# Altium schematic sheet STM32_BOARD_v1a_main.SchDoc: MCU & Motor Interface
size A4; Date: 2022-1-8; Author: Aljaž Murovec; DrawnBy: Aljaž murovec; Engineer: Aljaž Murovec; Revision: A; SheetNumber: 1; SheetTotal: 2
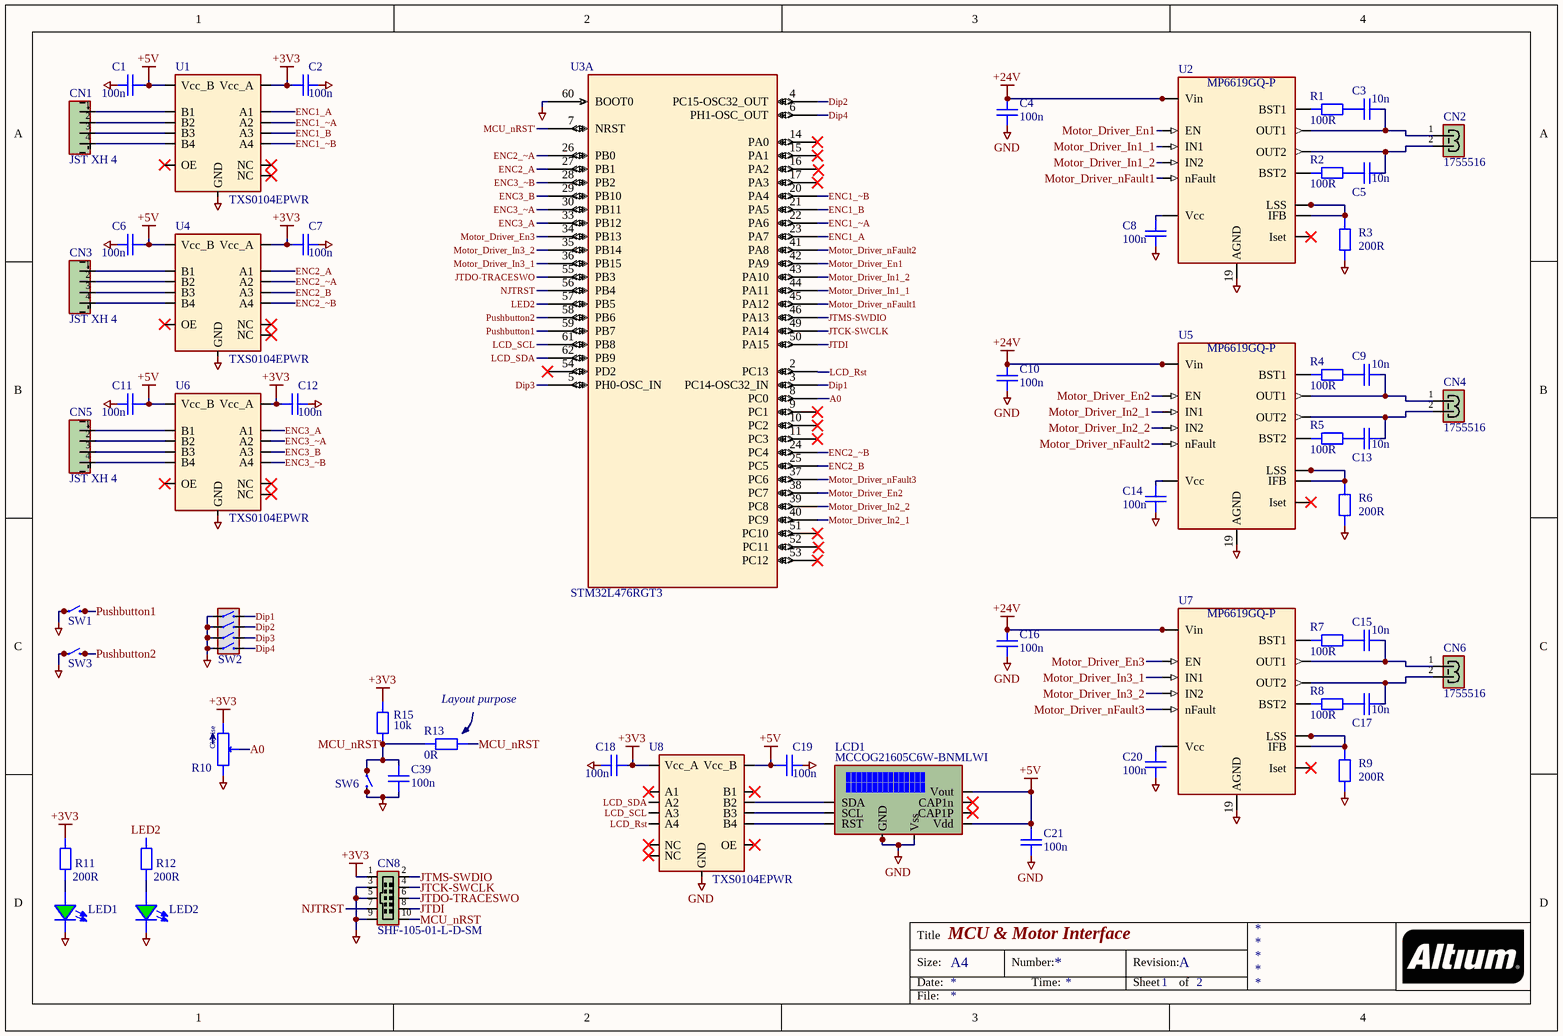
[diagram p0: STM32_BOARD_v1a_main.SchDoc]

## Parts
C1  100n  [CAP_SMD]
C2  100n  [CAP_SMD]
C3  10n  [CAP_SMD]
C4  100n  [CAP_SMD]
C5  10n  [CAP_SMD]
C6  100n  [CAP_SMD]
C7  100n  [CAP_SMD]
C8  100n  [CAP_SMD]
C9  10n  [CAP_SMD]
C10  100n  [CAP_SMD]
C11  100n  [CAP_SMD]
C12  100n  [CAP_SMD]
C13  10n  [CAP_SMD]
C14  100n  [CAP_SMD]
C15  10n  [CAP_SMD]
C16  100n  [CAP_SMD]
C17  10n  [CAP_SMD]
C18  100n  [CAP_SMD]
C19  100n  [CAP_SMD]
C20  100n  [CAP_SMD]
C21  100n  [CAP_SMD]
C39  100n  [CAP_SMD]
CN1  JST XH 4  [JST_XH_4-PIN]
CN2  PHOENIX_CONTACT_2x1_  [1755516]  (value not drawn)
CN3  JST XH 4  [JST_XH_4-PIN]
CN4  PHOENIX_CONTACT_2x1_  [1755516]  (value not drawn)
CN5  JST XH 4  [JST_XH_4-PIN]
CN6  PHOENIX_CONTACT_2x1_  [1755516]  (value not drawn)
CN8  SHF-105-01-L-D-SM  [SHF-105-01-L-D-SM]
LCD1  MCCOG21605C6W-BNMLWI  [MCCOG21605C6W-BNMLWI]
LED1  LED_SMD_GREEN  [LED_0805_GREEN]  (value not drawn)
LED2  LED_SMD_GREEN  [LED_0805_GREEN]  (value not drawn)
R1  100R  [RES_0805]
R2  100R  [RES_0805]
R3  200R  [RES_0805]
R4  100R  [RES_0805]
R5  100R  [RES_0805]
R6  200R  [RES_0805]
R7  100R  [RES_0805]
R8  100R  [RES_0805]
R9  200R  [RES_0805]
R10  TC33X-2-502E  [TC33X-2]  (value not drawn)
R11  200R  [RES_0805]
R12  200R  [RES_0805]
R13  0R  [RES_0805]
R15  10k  [RES_0805]
SW1  PTS645SM43SMTR92LFS  [Pushbutton_6x6mm]  (value not drawn)
SW2  A6H-4101  [A6H-4101]  (value not drawn)
SW3  PTS645SM43SMTR92LFS  [Pushbutton_6x6mm]  (value not drawn)
SW6  PTS645SM43SMTR92LFS  [Pushbutton_6x6mm]  (value not drawn)
U1  TXS0104EPWR  [TSOP65P640X120-14N]
U2  MP6619GQ-P  [MP6619GQ-P]
U3  32-bit Microcontroller  [LQFP64_10x10mm]  (value not drawn)  (part A of 2)
U4  TXS0104EPWR  [TSOP65P640X120-14N]
U5  MP6619GQ-P  [MP6619GQ-P]
U6  TXS0104EPWR  [TSOP65P640X120-14N]
U7  MP6619GQ-P  [MP6619GQ-P]
U8  TXS0104EPWR  [TSOP65P640X120-14N]

## Nets
+3V3: C2.2(Pin_2) C7.2(Pin_2) C12.2(Pin_2) C18.2(Pin_2) CN8.1(Pin1) R10.3(Pin_3) R11.2(Pin_2) R15.2(Pin_2) U1.1(Vcc_A) U4.1(Vcc_A) U6.1(Vcc_A) U8.1(Vcc_A)
+5V: C1.2(Pin_2) C6.2(Pin_2) C11.2(Pin_2) C19.2(Pin_2) C21.2(Pin_2) LCD1.1(Vout) LCD1.4(Vdd) U1.14(Vcc_B) U4.14(Vcc_B) U6.14(Vcc_B) U8.14(Vcc_B)
+24V: C4.2(Pin_2) C10.2(Pin_2) C16.2(Pin_2) U2.2(Vin) U2.11(Vin) U5.2(Vin) U5.11(Vin) U7.2(Vin) U7.11(Vin)
GND: C1.1(Pin_1) C2.1(Pin_1) C4.1(Pin_1) C6.1(Pin_1) C7.1(Pin_1) C8.1(Pin_1) C10.1(Pin_1) C11.1(Pin_1) C12.1(Pin_1) C14.1(Pin_1) C16.1(Pin_1) C18.1(Pin_1) C19.1(Pin_1) C20.1(Pin_1) C21.1(Pin_1) C39.1(Pin_1) CN8.3 CN8.5 CN8.9 LCD1.5(Vss) LCD1.G1(GND) LCD1.G2(GND) LED1.2(C) LED2.2(C) R3.1(Pin_1) R6.1(Pin_1) R9.1(Pin_1) R10.1(Pin_1) SW1.1(Pin_1) SW1.2(Pin_2) SW2.1(Pin_1) SW2.2(Pin_2) SW2.3(Pin_3) SW2.4(Pin_4) SW3.1(Pin_1) SW3.2(Pin_2) SW6.3(Pin_3) SW6.4(Pin_4) U1.7(GND) U2.19(AGND) U3.60(BOOT0) U4.7(GND) U5.19(AGND) U6.7(GND) U7.19(AGND) U8.7(GND)
A0: R10.2(Pin_2) U3.8(PC0)
Dip1: SW2.8(Pin_8) U3.3(PC14-OSC32_IN)
Dip2: SW2.7(Pin_7) U3.4(PC15-OSC32_OUT)
Dip3: SW2.6(Pin_6) U3.5(PH0-OSC_IN)
Dip4: SW2.5(Pin_5) U3.6(PH1-OSC_OUT)
ENC1_A: U1.2(A1) U3.23(PA7)
ENC1_B: U1.4(A3) U3.21(PA5)
ENC1_~A: U1.3(A2) U3.22(PA6)
ENC1_~B: U1.5(A4) U3.20(PA4)
ENC2_A: U3.27(PB1) U4.2(A1)
ENC2_B: U3.25(PC5) U4.4(A3)
ENC2_~A: U3.26(PB0) U4.3(A2)
ENC2_~B: U3.24(PC4) U4.5(A4)
ENC3_A: U3.33(PB12) U6.2(A1)
ENC3_B: U3.29(PB10) U6.4(A3)
ENC3_~A: U3.30(PB11) U6.3(A2)
ENC3_~B: U3.28(PB2) U6.5(A4)
JTCK-SWCLK: CN8.4 U3.49(PA14)
JTDI: CN8.8 U3.50(PA15)
JTDO-TRACESWO: CN8.6 U3.55(PB3)
JTMS-SWDIO: CN8.2(Pin2) U3.46(PA13)
LCD_Rst: U3.2(PC13) U8.5(A4)
LCD_SCL: U3.61(PB8) U8.4(A3)
LCD_SDA: U3.62(PB9) U8.3(A2)
LED2: R12.2(Pin_2) U3.57(PB5)
MCU_nRST: CN8.10 R13.1(Pin_1)
MCU_nRST': C39.2(Pin_2) R13.2(Pin_2) R15.1(Pin_1) SW6.1(Pin_1) SW6.2(Pin_2) U3.7(NRST)
Motor_Driver_En1: U2.5(EN) U3.42(PA9)
Motor_Driver_En2: U3.38(PC7) U5.5(EN)
Motor_Driver_En3: U3.34(PB13) U7.5(EN)
Motor_Driver_In1_1: U2.15(IN1) U3.44(PA11)
Motor_Driver_In1_2: U2.16(IN2) U3.43(PA10)
Motor_Driver_In2_1: U3.40(PC9) U5.15(IN1)
Motor_Driver_In2_2: U3.39(PC8) U5.16(IN2)
Motor_Driver_In3_1: U3.36(PB15) U7.15(IN1)
Motor_Driver_In3_2: U3.35(PB14) U7.16(IN2)
Motor_Driver_nFault1: U2.13(nFault) U3.45(PA12)
Motor_Driver_nFault2: U3.41(PA8) U5.13(nFault)
Motor_Driver_nFault3: U3.37(PC6) U7.13(nFault)
NJTRST: CN8.7 U3.56(PB4)
Pushbutton1: SW1.3(Pin_3) SW1.4(Pin_4) U3.59(PB7)
Pushbutton2: SW3.3(Pin_3) SW3.4(Pin_4) U3.58(PB6)
NetC3_1: C3.1(Pin_1) R1.2(Pin_2)
NetC3_2: C3.2(Pin_2) CN2.1(Pin_1) U2.10(OUT1)
NetC5_1: C5.1(Pin_1) R2.2(Pin_2)
NetC5_2: C5.2(Pin_2) CN2.2(Pin_2) U2.3(OUT2)
NetC8_2: C8.2(Pin_2) U2.14(Vcc)
NetC9_1: C9.1(Pin_1) R4.2(Pin_2)
NetC9_2: C9.2(Pin_2) CN4.1(Pin_1) U5.10(OUT1)
NetC13_1: C13.1(Pin_1) R5.2(Pin_2)
NetC13_2: C13.2(Pin_2) CN4.2(Pin_2) U5.3(OUT2)
NetC14_2: C14.2(Pin_2) U5.14(Vcc)
NetC15_1: C15.1(Pin_1) R7.2(Pin_2)
NetC15_2: C15.2(Pin_2) CN6.1(Pin_1) U7.10(OUT1)
NetC17_1: C17.1(Pin_1) R8.2(Pin_2)
NetC17_2: C17.2(Pin_2) CN6.2(Pin_2) U7.3(OUT2)
NetC20_2: C20.2(Pin_2) U7.14(Vcc)
NetCN1_1: CN1.1(Pin_1) U1.13(B1)
NetCN1_2: CN1.2(Pin_2) U1.12(B2)
NetCN1_3: CN1.3(Pin_3) U1.11(B3)
NetCN1_4: CN1.4(Pin_4) U1.10(B4)
NetCN3_1: CN3.1(Pin_1) U4.13(B1)
NetCN3_2: CN3.2(Pin_2) U4.12(B2)
NetCN3_3: CN3.3(Pin_3) U4.11(B3)
NetCN3_4: CN3.4(Pin_4) U4.10(B4)
NetCN5_1: CN5.1(Pin_1) U6.13(B1)
NetCN5_2: CN5.2(Pin_2) U6.12(B2)
NetCN5_3: CN5.3(Pin_3) U6.11(B3)
NetCN5_4: CN5.4(Pin_4) U6.10(B4)
NetLCD1_6: LCD1.6(SDA) U8.12(B2)
NetLCD1_7: LCD1.7(SCL) U8.11(B3)
NetLCD1_8: LCD1.8(RST) U8.10(B4)
NetLED1_1: LED1.1(A) R11.1(Pin_1)
NetLED2_1: LED2.1(A) R12.1(Pin_1)
NetR1_1: R1.1(Pin_1) U2.9(BST1)
NetR2_1: R2.1(Pin_1) U2.4(BST2)
NetR3_2: R3.2(Pin_2) U2.1(IFB) U2.6(LSS) U2.7(LSS) U2.8(LSS)
NetR4_1: R4.1(Pin_1) U5.9(BST1)
NetR5_1: R5.1(Pin_1) U5.4(BST2)
NetR6_2: R6.2(Pin_2) U5.1(IFB) U5.6(LSS) U5.7(LSS) U5.8(LSS)
NetR7_1: R7.1(Pin_1) U7.9(BST1)
NetR8_1: R8.1(Pin_1) U7.4(BST2)
NetR9_2: R9.2(Pin_2) U7.1(IFB) U7.6(LSS) U7.7(LSS) U7.8(LSS)

Not connected (* = marked no-connect by the designer): LCD1 2(CAP1n)* 3(CAP1P)*; U1 6(NC)* 8(OE)* 9(NC)*; U2 17(Iset)*; U3 9(PC1)* 10(PC2)* 11(PC3)* 14(PA0)* 15(PA1)* 16(PA2) 17(PA3)* 51(PC10)* 52(PC11) 53(PC12)* 54(PD2)*; U4 6(NC)* 8(OE)* 9(NC)*; U5 17(Iset)*; U6 6(NC)* 8(OE)* 9(NC)*; U7 17(Iset)*; U8 2(A1)* 6(NC)* 8(OE)* 9(NC)* 13(B1)*

## Notes on the sheet
- Layout purpose
- Title
- Size:
- Date:
- A4
- Number:
- Time:
- Revision:
- Sheet
- of
- File:
- (in symbol TC33X-2-502E) Ckwise

## Library data of the parts
C1-C21 C39 = C: Voltage Rating: *; Temperature Range: -55~125°C; Tolerance: *
  C1 C2 C4 C6-C8 C10-C12 C14 C16 C18-C21 C39: Capacitance: 100n
  C3 C5 C9 C13 C15 C17: Capacitance: 10n
CN1 CN3 CN5 = JST_XH_4_PIN: JST XH 4 Pin Connector; Manufacturer: JASO; Mfr Part Num.: JST XH 4
CN2 CN4 CN6 = PHOENIX_CONTACT_2x1_: Pin header, straight, Straight, 5mm Pitch, 2 Poles, Phoenix Contact; Manufacturer: Phoenix Contact; Mfr Part Num.: 1755516
CN8 = SHF-105-01-L-D-SM: Pin Header, Vertical, Wire-to-Board, 1.27 mm, 2 Rows, 10 Contacts, Surface Mount, SHF; Manufacturer: Samtec; Mfr. Part Number: SHF-105-01-L-D-SM
LCD1 = MCCOG21605C6W-BNMLWI: Alphanumeric LCD, 16 x 2, White on Blue, 3V to 5V, I2C, English, Japanese, Transmissive; Manufacturer: MIDAS; Mfr Part Num.: MCCOG21605C6W-BNMLWI
R1-R9 R11-R13 R15 = R: Tolerance: *
  R1 R2 R4 R5 R7 R8: Resistance: 100R
  R3 R6 R9 R11 R12: Resistance: 200R
  R13: Resistance: 0R
  R15: Resistance: 10k
R10 = TC33X-2-502E: Trimpot, Single Turn, Cermet, Top Adjust, 5 kohm, Surface Mount, 1 Turns; Manufacturer: Bourns; Power Rating: 100mW; Value: 5k; Mfr Part Num.: TC33X-2-502E
SW1 SW3 SW6 = PTS645SM43SMTR92LFS: Tactile Switch, PT645, Top Actuated, Surface Mount, Round Button, 160 gf, 50mA at 12VDC; Manufacturer: C&K Components; Voltage: 12V; Mfr Part Num.: PTS645SM43SMTR92LFS; Current: 50mA
SW2 = A6H-4101: DIP / SIP Switch, 4 Circuits, Slide, Surface Mount, SPST, 24 VDC, 25 mA; Manufacturer: Omron; Voltage: 24V; Current: 25mA; Mfr Part Num.: A6H-4101
U1 U4 U6 U8 = TXS0104E: Voltage Level Translator, 4 Input, 50 mA, 4.6 ns, 1.65 V to 5.5 V, TSSOP-14; Manufacturer: Texas Instruments; Supply Voltage: 1.65V~5.5V; Output Current: 50mA; Mfr Part Num.: TXS0104EPWR
U2 U5 U7 = MP6619GQ-P: H-Bridge Motor driver; Manufacturer: MPS; Supply Voltage: 5.4V~28V; Output Current: 5A; Mfr Part Num: MP6619GQ-P
U3 = STM32L476RGT3: STM32 Arm-based 32-bit Microcontroller; Manufacturer: STMicroelectronics; Supply Voltage: 1.7V~3.6V; RAM Memory Size: 128kB; CPU Speed: 80MHz; Program Memory Size: 1MB; Temperature range: -40~125°C; Mfr Part Num: STM32L476RGT3
LED1 LED2 = LED_SMD_GREEN: Current: *; Forward Voltage: *; Manufacturer: *; Mfr Part Num.: *